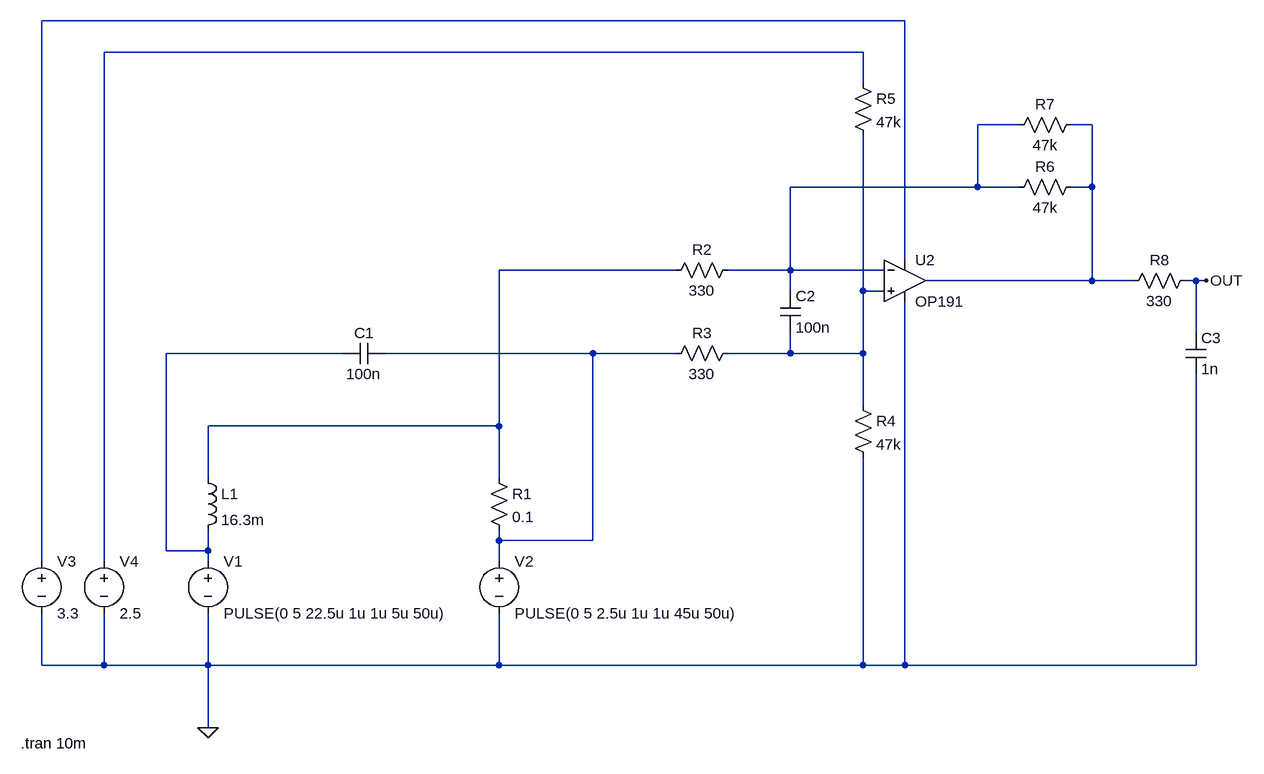
[diagram p0: schematic diff_to_single.asc]
diff_to_single.asc, the LTspice schematic file:
Version 4
SHEET 1 1236 680
WIRE 704 -592 -624 -592
WIRE 640 -544 -528 -544
WIRE 640 -496 640 -544
WIRE 880 -432 816 -432
WIRE 992 -432 960 -432
WIRE 816 -336 816 -432
WIRE 816 -336 528 -336
WIRE 880 -336 816 -336
WIRE 992 -336 992 -432
WIRE 992 -336 960 -336
WIRE 704 -224 704 -592
WIRE 352 -208 80 -208
WIRE 528 -208 528 -336
WIRE 528 -208 432 -208
WIRE 672 -208 528 -208
WIRE 992 -192 992 -336
WIRE 992 -192 736 -192
WIRE 1056 -192 992 -192
WIRE 1152 -192 1136 -192
WIRE 1168 -192 1152 -192
WIRE 528 -176 528 -208
WIRE 640 -176 640 -416
WIRE 672 -176 640 -176
WIRE 1152 -112 1152 -192
WIRE -160 -80 -432 -80
WIRE 224 -80 -96 -80
WIRE 352 -80 224 -80
WIRE 528 -80 528 -112
WIRE 528 -80 432 -80
WIRE 640 -80 640 -176
WIRE 640 -80 528 -80
WIRE 640 0 640 -80
WIRE 80 32 80 -208
WIRE 80 32 -368 32
WIRE -368 112 -368 32
WIRE 80 112 80 32
WIRE 80 208 80 192
WIRE 224 208 224 -80
WIRE 224 208 80 208
WIRE -432 224 -432 -80
WIRE -368 224 -368 192
WIRE -368 224 -432 224
WIRE -624 240 -624 -592
WIRE -528 240 -528 -544
WIRE -368 240 -368 224
WIRE 80 240 80 208
WIRE -624 400 -624 320
WIRE -528 400 -528 320
WIRE -528 400 -624 400
WIRE -368 400 -368 320
WIRE -368 400 -528 400
WIRE 80 400 80 320
WIRE 80 400 -368 400
WIRE 640 400 640 80
WIRE 640 400 80 400
WIRE 704 400 704 -160
WIRE 704 400 640 400
WIRE 1152 400 1152 -48
WIRE 1152 400 704 400
WIRE -368 496 -368 400
FLAG -368 496 0
FLAG 1168 -192 OUT
SYMBOL voltage -368 224 R0
WINDOW 123 0 0 Left 0
WINDOW 39 0 0 Left 0
SYMATTR InstName V1
SYMATTR Value PULSE(0 5 22.5u 1u 1u 5u 50u)
SYMBOL voltage 80 224 R0
WINDOW 123 0 0 Left 0
WINDOW 39 0 0 Left 0
SYMATTR InstName V2
SYMATTR Value PULSE(0 5 2.5u 1u 1u 45u 50u)
SYMBOL res 64 96 R0
SYMATTR InstName R1
SYMATTR Value 0.1
SYMBOL ind -384 96 R0
SYMATTR InstName L1
SYMATTR Value 16.3m
SYMATTR SpiceLine Rser=42
SYMBOL res 448 -224 R90
WINDOW 0 0 56 VBottom 2
WINDOW 3 32 56 VTop 2
SYMATTR InstName R2
SYMATTR Value 330
SYMATTR SpiceLine tol=1
SYMBOL res 448 -96 R90
WINDOW 0 0 56 VBottom 2
WINDOW 3 32 56 VTop 2
SYMATTR InstName R3
SYMATTR Value 330
SYMATTR SpiceLine tol=1
SYMBOL res 624 -16 R0
SYMATTR InstName R4
SYMATTR Value 47k
SYMATTR SpiceLine tol=1
SYMBOL voltage -624 224 R0
WINDOW 123 0 0 Left 0
WINDOW 39 0 0 Left 0
SYMATTR InstName V3
SYMATTR Value 3.3
SYMBOL Opamps\\OP191 704 -256 R0
SYMATTR InstName U2
SYMBOL res 624 -512 R0
SYMATTR InstName R5
SYMATTR Value 47k
SYMATTR SpiceLine tol=1
SYMBOL voltage -528 224 R0
WINDOW 123 0 0 Left 0
WINDOW 39 0 0 Left 0
SYMATTR InstName V4
SYMATTR Value 2.5
SYMBOL res 976 -352 R90
WINDOW 0 0 56 VBottom 2
WINDOW 3 32 56 VTop 2
SYMATTR InstName R6
SYMATTR Value 47k
SYMATTR SpiceLine tol=1
SYMBOL res 976 -448 R90
WINDOW 0 0 56 VBottom 2
WINDOW 3 32 56 VTop 2
SYMATTR InstName R7
SYMATTR Value 47k
SYMATTR SpiceLine tol=1
SYMBOL cap -96 -96 R90
WINDOW 0 0 32 VBottom 2
WINDOW 3 32 32 VTop 2
SYMATTR InstName C1
SYMATTR Value 100n
SYMBOL cap 512 -176 R0
SYMATTR InstName C2
SYMATTR Value 100n
SYMBOL res 1152 -208 R90
WINDOW 0 0 56 VBottom 2
WINDOW 3 32 56 VTop 2
SYMATTR InstName R8
SYMATTR Value 330
SYMBOL cap 1136 -112 R0
SYMATTR InstName C3
SYMATTR Value 1n
TEXT -656 520 Left 2 !.tran 10m

The netlist it stands for:
* diff_to_single.asc
V1 N007 0 PULSE(0 5 22.5u 1u 1u 5u 50u)
V2 N008 0 PULSE(0 5 2.5u 1u 1u 45u 50u)
R1 N005 N008 0.1
L1 N005 N007 16.3m Rser=42
R2 N003 N005 330 tol=1
R3 N006 N008 330 tol=1
R4 N006 0 47k tol=1
V3 N001 0 3.3
XU2 N006 N003 N001 0 N004 OP191  ; pins In+ In- V+ V- OUT
R5 N002 N006 47k tol=1
V4 N002 0 2.5
R6 N004 N003 47k tol=1
R7 N004 N003 47k tol=1
C1 N008 N007 100n
C2 N003 N006 100n
R8 OUT N004 330
C3 OUT 0 1n
.tran 10m
.lib ADI.lib
.backanno
.end